# EasyEDA Pro project RPi Pico 2+.epro

# Schematic Schematic1
Board Name: Board1; Create Date: 2025-11-03; Page Name: P1; Project Name: RPi Pico 2 Plus; Schematic Name: Schematic1; Update Date: 2025-11-04; Company: EasyEDA.com; Page Size: A4; Version: V1.0
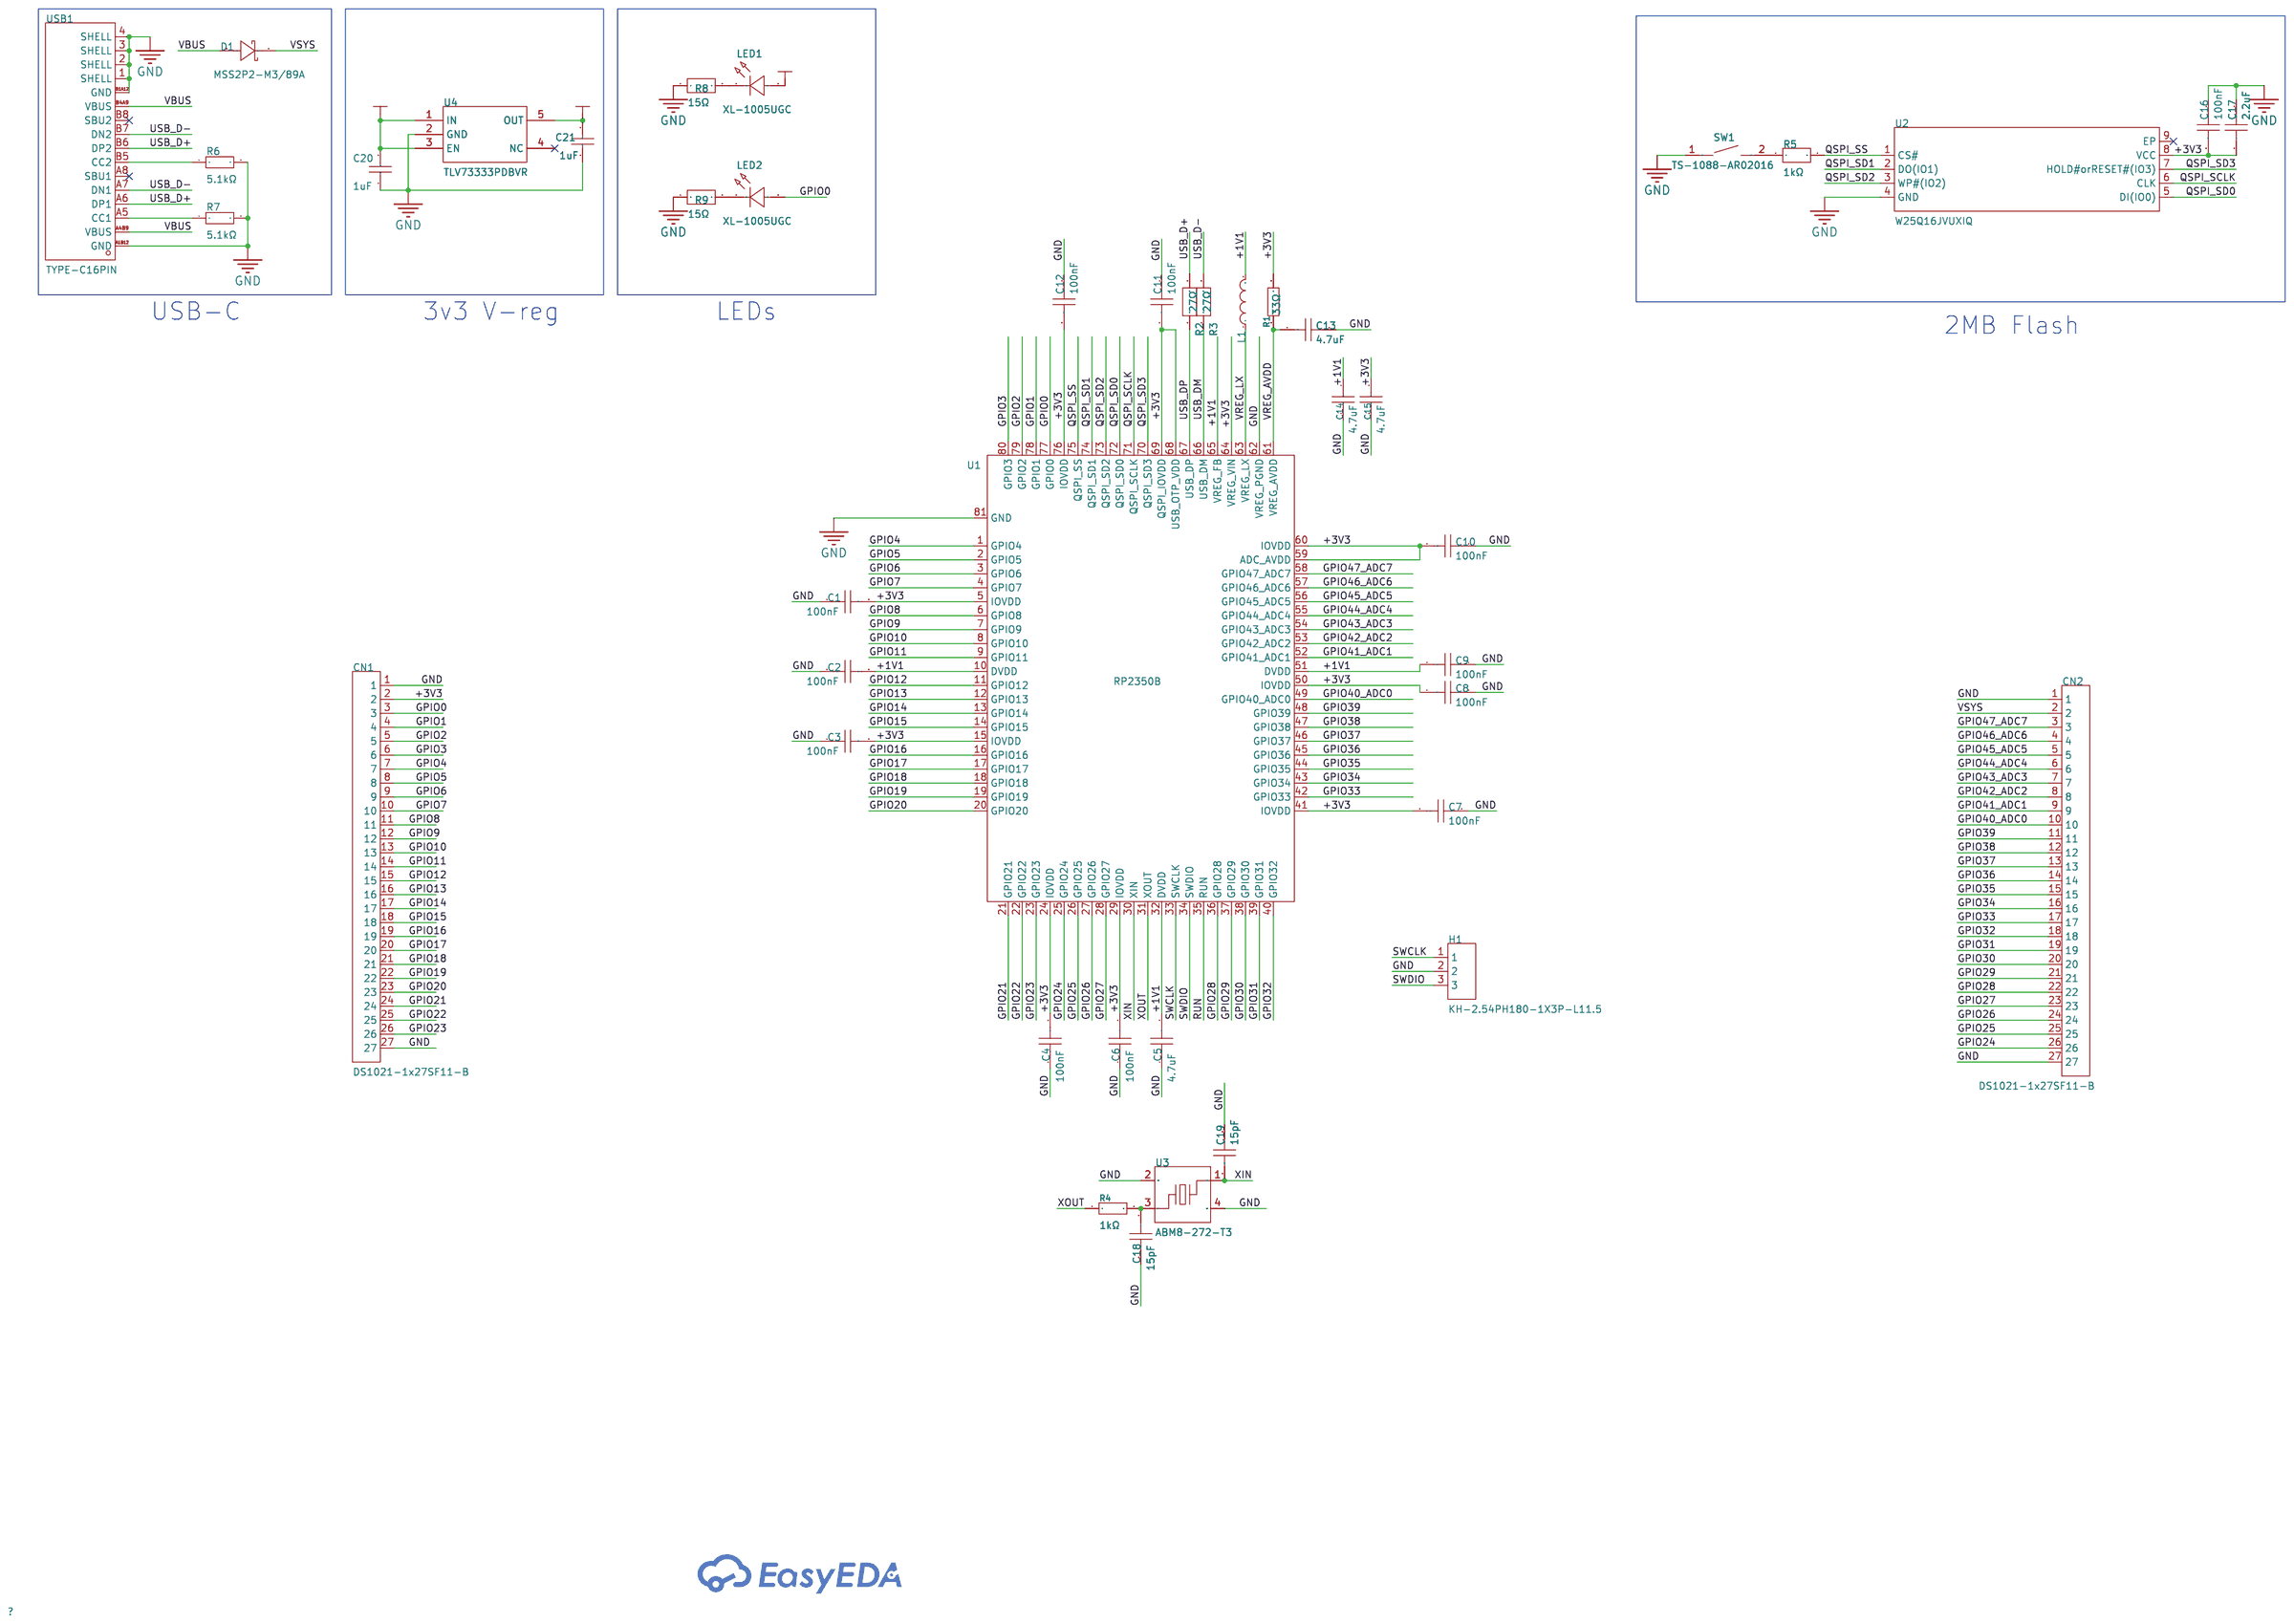
[diagram p0: schematic sheet]

## Parts
C1  100nF  [C0201]
C2  100nF  [C0201]
C3  100nF  [C0201]
C4  100nF  [C0201]
C5  4.7uF  [C0201]
C6  100nF  [C0201]
C7  100nF  [C0201]
C8  100nF  [C0201]
C9  100nF  [C0201]
C10  100nF  [C0201]
C11  100nF  [C0201]
C12  100nF  [C0201]
C13  4.7uF  [C0201]
C14  4.7uF  [C0402]
C15  4.7uF  [C0402]
C16  100nF  [C0201]
C17  2.2uF  [C0201]
C18  15pF  [C0201]
C19  15pF  [C0201]
C20  1uF  [C0201]
C21  1uF  [C0201]
CN1  DS1021-1x27SF11-B  [HDR-TH_27P-P2.54-V-M]  (no BOM)
CN2  DS1021-1x27SF11-B  [HDR-TH_27P-P2.54-V-M]  (no BOM)
D1  MSS2P2-M3/89A  [DO-219AD_L2.2-W1.3-L-RD_MSS2P2-M3-89A]
H1  KH-2.54PH180-1X3P-L11.5  [HDR-TH_3P-P2.54-V-M]  (no BOM)
L1  AOTA-B201610S3R3-101-T  [IND-SMD_L2.0-W1.6_AOTA-B201610S3R3-101-T]
LED1  XL-1005UGC  [LED0402-RD_GREEN]
LED2  XL-1005UGC  [LED0402-RD_GREEN]
R1  33Ω  [R0201]
R2  27Ω  [R0201]
R3  27Ω  [R0201]
R4  1kΩ  [R0201]
R5  1kΩ  [R0201]
R6  5.1kΩ  [R0201]
R7  5.1kΩ  [R0201]
R8  15Ω  [R0402]
R9  15Ω  [R0402]
SW1  TS-1088-AR02016  [SW-SMD_L3.9-W3.0-P4.45]
U1  RP2350B  [QFN-80_L10.0-W10.0-P0.40-TL-EP3.4]
U2  W25Q16JVUXIQ  [USON-8_L3.0-W2.0-P0.50-BL-EP]
U3  ABM8-272-T3  [CRYSTAL-SMD_4P-L3.2-W2.5-BL]
U4  TLV73333PDBVR  [SOT-23-5_L3.0-W1.7-P0.95-LS2.8-BR]
USB1  TYPE-C16PIN  [USB-C-SMD_TYPE-C16PIN]

## Library data of the parts
C1-C4 C6-C12 C16 = GRM033R60J104KE19D: Capacitance: Tolerance:±10% Tolerance:±10% Voltage Rated: Temperature Coefficient:; LCSC Part Name: 100nF ±10% 6.3V; Supplier Part: C76928; Manufacturer: muRata(村田); Supplier Footprint: 0201; Datasheet: https://atta.szlcsc.com/upload/public/pdf/source/20180307/C76928_15204090936861407718.pdf; Supplier: LCSC; Tolerance: ±10%
C5 C13 = GRM035R60J475ME15D: Capacitance:4.7uF Tolerance:±20% Tolerance:±20% Voltage Rating:6.3V Temperature Coefficient:X5R; LCSC Part Name: 4.7uF ±20% 6.3V; Supplier Part: C335103; Manufacturer: muRata(村田); Supplier Footprint: 0201; Datasheet: https://item.szlcsc.com/datasheet/GRM035R60J475ME15D/313624.html; Supplier: LCSC; Tolerance: ±20%; Voltage Rating: 6.3V; Temperature Coefficient: X5R
C14 C15 = CL05A475MP5NRNC: Capacitance:4.7uF Tolerance:±20% Tolerance:±20% Voltage Rating:10V Temperature Coefficient:X5R; LCSC Part Name: 4.7uF ±20% 10V; Supplier Part: C23733; Manufacturer: SAMSUNG(三星); Supplier Footprint: 0402; Datasheet: https://item.szlcsc.com/datasheet/CL05A475MP5NRNC/24469.html; Supplier: LCSC; Tolerance: ±20%; Voltage Rating: 10V; Temperature Coefficient: X5R
C17 = 0201X225M6R3NT: Capacitance:2.2uF Tolerance:±20% Tolerance:±20% Voltage Rating:6.3V Temperature Coefficient:X5R; LCSC Part Name: 2.2uF ±20% 6.3V; Supplier Part: C285111; Manufacturer: FH(风华); Supplier Footprint: 0201; JLCPCB Part Class: Extended Part; Datasheet: https://atta.szlcsc.com/upload/public/pdf/source/20200305/C486355_26A10D38EF8C2A5C37091D0039909270.pdf; Supplier: LCSC; Tolerance: ±20%; Voltage Rating: 6.3V; Temperature Coefficient: X5R
C18 C19 = CC0201JRNPO9BN150: Capacitance: Tolerance:±5% Tolerance:±5% Voltage Rated: Temperature Coefficient:; LCSC Part Name: 15pF ±5% 50V; Supplier Part: C277480; Manufacturer: YAGEO(国巨); Supplier Footprint: 0201; JLCPCB Part Class: Extended Part; Datasheet: https://atta.szlcsc.com/upload/public/pdf/source/20181008/C309499_21CC21451B82C39E3D92150FD6B30293.pdf; Supplier: LCSC; Tolerance: ±5%
C20 C21 = CL03A105MQ3CSNH: Capacitance:1uF Tolerance:±20% Tolerance:±20% Voltage Rating:6.3V Temperature Coefficient:X5R; LCSC Part Name: 1uF ±20% 6.3V; Supplier Part: C53067; Manufacturer: SAMSUNG(三星); Supplier Footprint: 0201; JLCPCB Part Class: Extended Part; Datasheet: https://item.szlcsc.com/datasheet/CL03A105MQ3CSNH/54083.html; Supplier: LCSC; Tolerance: ±20%; Voltage Rating: 6.3V; Temperature Coefficient: X5R
CN1 CN2 = DS1021-1x27SF11-B: Pin Structure:1x27P Pitch:2.54mm Mounting Type:Straight Number of Rows:Single Row Number of Pins:27P; LCSC Part Name: 1x27P 间距:2.54mm 直插; Supplier Part: C7430383; Manufacturer: CONNFLY; Supplier Footprint: 插件,P=2.54mm; JLCPCB Part Class: Extended Part; Datasheet: https://atta.szlcsc.com/upload/public/pdf/source/20241114/4F2B0C155C1138FA911DFA8877210959.pdf; Supplier: LCSC; Pin Structure: 1x27P; Pitch: 2.54mm; Mounting Type: Straight; Number of Rows: Single Row; Number of Pins: 27P
D1 = MSS2P2-M3/89A: Diode Configuration:1 Independent Voltage - Forward(Vf@If):520mV@2A Voltage - DC Reverse(Vr):20V Current - Rectified:2A Reverse Leakage Current (Ir):250uA@20V Operating Junction Temperature Range:-55℃~+150℃ Operating Junction Temperature Range:-55℃~+150℃; LCSC Part Name: 电压:20V 电流:2A; Supplier Part: C2978531; Manufacturer: VISHAY(威世); Supplier Footprint: MicroSMP; JLCPCB Part Class: Extended Part; Datasheet: https://item.szlcsc.com/datasheet/MSS2P2-M3%252F89A/3391953.html; Supplier: LCSC; Diode Configuration: 1 Independent; Voltage - Forward(Vf@If): 520mV@2A; Voltage - DC Reverse(Vr): 20V; Current - Rectified: 2A; Reverse Leakage Current (Ir): 250uA@20V; Operating Junction Temperature Range: -55℃~+150℃; Non-Repetitive Peak Forward Surge Current: 30A
H1 = KH-2.54PH180-1X3P-L11.5: Pin Structure:1x3P Pitch:2.54mm Row Spacing:- Circluar Pins/Square Pins:Policy Mounting Type:Straight Number of Rows:Single Row Number of Pins:3P Current Rating:3A Voltage Rating (Max):- Length of Mating Pin:6mm Insulation Height:2.5mm Length of End Conne; LCSC Part Name: 1x3P 间距:2.54mm 方针 直插; Supplier Part: C2932698; Manufacturer: kinghelm(金航标); Supplier Footprint: 插件,P=2.54mm; JLCPCB Part Class: Extended Part; Datasheet: https://atta.szlcsc.com/upload/public/pdf/source/20211220/D2AB060C07EA7DD91A5B4AA994AB98CA.pdf; Supplier: LCSC; Pin Structure: 1x3P; Pitch: 2.54mm; Circluar Pins/Square Pins: Policy; Mounting Type: Straight; Number of Rows: Single Row; Number of Pins: 3P; Current Rating: 3A; Length of Mating Pin: 6mm; Insulation Height: 2.5mm; Length of End Connection Pin: 3mm; Operating Temperature: -40℃~+105℃; Color: Black
L1 = AOTA-B201610S3R3-101-T: Supplier Part: C42411119; Manufacturer: ABRACON; Supplier Footprint: 0806; Datasheet: https://item.szlcsc.com/datasheet/AOTA-B201610S3R3-101-T/44392932.html; Supplier: LCSC
LED1 LED2 = XL-1005UGC_C965793: Illumination Color:Emerald Green Voltage - Forward(Vf):3V Voltage - Forward(Vf):3V Power(Watts):80mW Forward Current:25mA Wavelength - Dominant:516nm~531nm Wavelength - Dominant:516nm~531nm Peak Wavelength:531nm Lens Color:Water Clear Color Temperature:-; LCSC Part Name: 0402翠绿贴片式发光二极管; Supplier Part: C965793; Manufacturer: XINGLIGHT(成兴光); Supplier Footprint: 0402; Datasheet: https://item.szlcsc.com/datasheet/XL-1005UGC/1051402.html; Supplier: LCSC; Illumination Color: Emerald Green; Voltage - Forward(Vf): 3V; Power(Watts): 80mW; Forward Current: 25mA; Wavelength - Dominant: 516nm~531nm; Peak Wavelength: 531nm; Lens Color: Water Clear; Luminous Intensity: 249mcd; Viewing Angle: 120°; Mounting Style: op View Mount; Operating Temperature: -40℃~+85℃
R1 = 0201WMJ0330TEE: Type:Thick Film Resistor Resistance:33Ω Tolerance:±5% Tolerance:±5% Power(Watts):50mW Voltage-Supply(Max):25V Temperature Coefficient:±200ppm/℃ Temperature Coefficient:±200ppm/℃ Operating Temperature:-55℃~+155℃ Operating Temperature:-55℃~+155℃; LCSC Part Name: 33Ω ±5% 50mW 厚膜电阻; Supplier Part: C423356; Manufacturer: UNI-ROYAL(厚声); Supplier Footprint: 0201; JLCPCB Part Class: Extended Part; Datasheet: https://item.szlcsc.com/datasheet/0201WMJ0330TEE/416306.html; Supplier: LCSC; Type: Thick Film Resistor; Tolerance: ±5%; Power(Watts): 50mW; Voltage-Supply(Max): 25V; Temperature Coefficient: ±200ppm/℃; Operating Temperature: -55℃~+155℃
R2 R3 = 0201WMF270JTEE: Type:Thick Film Resistors Resistance:27Ω Tolerance:±1% Tolerance:±1% Power(Watts): Overload Voltage (Max): Temperature Coefficient:±200ppm/℃ Temperature Coefficient:±200ppm/℃ Operating Temperature Range:-55℃~+155℃ Operating Temperature Range:-55℃~+155℃; LCSC Part Name: 27Ω ±1% 50mW 厚膜电阻; Supplier Part: C473051; Manufacturer: UNI-ROYAL(厚声); Supplier Footprint: 0201; JLCPCB Part Class: Extended Part; Datasheet: https://atta.szlcsc.com/upload/public/pdf/source/20200306/C422600_1E6D84923E4A46A82E41ADD87F860B5C.pdf; Supplier: LCSC; Type: Thick Film Resistors; Tolerance: ±1%; Temperature Coefficient: ±200ppm/℃; Operating Temperature Range: -55℃~+155℃
R4 = RTT01102JTH: Type:Thick Film Resistor Resistance:1kΩ Tolerance:±5% Tolerance:±5% Power(Watts):50mW Voltage-Supply(Max):25V Temperature Coefficient:±200ppm/℃ Temperature Coefficient:±200ppm/℃ Operating Temperature:-55℃~+125℃ Operating Temperature:-55℃~+125℃; LCSC Part Name: 厚膜电阻 1kΩ ±5% 50mW; Supplier Part: C102689; Manufacturer: RALEC(旺诠); Supplier Footprint: 0201; JLCPCB Part Class: Extended Part; Datasheet: https://item.szlcsc.com/datasheet/RTT01102JTH/103904.html; Supplier: LCSC; Type: Thick Film Resistor; Tolerance: ±5%; Power(Watts): 50mW; Voltage-Supply(Max): 25V; Temperature Coefficient: ±200ppm/℃; Operating Temperature: -55℃~+125℃
R5 = FRC0201F1001TS: Type:Thick Film Resistor Resistance:1kΩ Tolerance:±1% Tolerance:±1% Power(Watts):50mW Temperature Coefficient:±200ppm/℃ Temperature Coefficient:±200ppm/℃; LCSC Part Name: 厚膜电阻 1kΩ ±1% 50mW; Supplier Part: C7467283; Manufacturer: FOJAN(富捷); Supplier Footprint: 0201; JLCPCB Part Class: Extended Part; Datasheet: https://atta.szlcsc.com/upload/public/pdf/source/20230915/D88BDA77B27A9698C44CA869125B965F.pdf; Supplier: LCSC; Type: Thick Film Resistor; Tolerance: ±1%; Power(Watts): 50mW; Temperature Coefficient: ±200ppm/℃
R6 R7 = RC0201FR-075K1L: Type:Thick Film Resistors Resistance: Tolerance:±1% Tolerance:±1% Power(Watts): Overload Voltage (Max): Temperature Coefficient:±200ppm/℃ Temperature Coefficient:±200ppm/℃ Operating Temperature Range:-55℃~+125℃ Operating Temperature Range:-55℃~+125℃; LCSC Part Name: 厚膜电阻 5.1kΩ ±1% 50mW; Supplier Part: C274341; Manufacturer: YAGEO(国巨); Supplier Footprint: 0201; JLCPCB Part Class: Extended Part; Datasheet: https://atta.szlcsc.com/upload/public/pdf/source/20180821/C275644_0D56F95EFF785E7D9A1FEF436B37DA78.pdf; Supplier: LCSC; Type: Thick Film Resistors; Tolerance: ±1%; Temperature Coefficient: ±200ppm/℃; Operating Temperature Range: -55℃~+125℃
R8 R9 = SCR0402J15R: Type:Thick Film Resistor Resistance:15Ω Tolerance:±5% Tolerance:±5% Power(Watts):62.5mW Voltage-Supply(Max):50V Operating Temperature:-55℃~+155℃ Operating Temperature:-55℃~+155℃; LCSC Part Name: 厚膜电阻 15Ω ±5% 62.5mW; Supplier Part: C3017452; Manufacturer: VO(翔胜); Supplier Footprint: 0402; Datasheet: https://atta.szlcsc.com/upload/public/pdf/source/20220513/247AF9639BA21CF93567DC289CCC6A22.pdf; Supplier: LCSC; Type: Thick Film Resistor; Tolerance: ±5%; Power(Watts): 62.5mW; Voltage-Supply(Max): 50V; Operating Temperature: -55℃~+155℃
SW1 = TS-1088-AR02016: Circuit:SPST Actuator Style:Round Button Operating Force:160gf Mounting Style:Brick nogging Switch Length:4mm Switch Width:3mm Switch Height:2mm Strike Gundam:不带 Contact Current:50mA Voltage Rating (DC):12V Insulation Resistance:100MΩ Actuator/Cap Color:B; LCSC Part Name: 4*3*2mm 立贴 轻触开关; Supplier Part: C720477; Manufacturer: XUNPU(讯普); Supplier Footprint: SMD; JLCPCB Part Class: Basic Part; Datasheet: https://atta.szlcsc.com/upload/public/pdf/source/20200810/C720475_60D09DD6C54279ADDB2DC25100F1CC11.pdf; Supplier: LCSC; Circuit: SPST; Actuator Style: Round Button; Operating Force: 160gf; Mounting Style: Brick nogging; Switch Length: 4mm; Switch Width: 3mm; Switch Height: 2mm; Strike Gundam: 不带; Contact Current: 50mA; Voltage Rating (DC): 12V; Insulation Resistance: 100MΩ; Actuator/Cap Color: Black; Pin Style: SMDSplicing; Mechanical Life: 10万次; Operating Temperature: -30℃~+80℃
U1 = RP2350B_C42415655: LCSC Part Name: 微控制器; Supplier Part: C42415655; Manufacturer: Raspberry Pi(树莓派); Supplier Footprint: QFN-80-EP(10x10); JLCPCB Part Class: Extended Part; Datasheet: https://item.szlcsc.com/datasheet/RP2350B/44413055.html; Supplier: LCSC
U2 = W25Q16JVUXIQ: Interface:SPI Memory Size:16Mbit Clock Frequency:133MHz Voltage - Supply:2.7V~3.6V Voltage - Supply:2.7V~3.6V Program / Erase Cycles:100,000 Cycles Page Programming Time (Tpp):3ms Data Retention - TDR (Year):20 Years; Supplier Part: C2843335; Manufacturer: Winbond(华邦); Supplier Footprint: USON-8-EP(2x3); Datasheet: https://atta.szlcsc.com/upload/public/pdf/source/20210629/C2843335_FB4D78B5076715625DC0C83F790D3044.pdf; Supplier: LCSC; Interface: SPI; Memory Size: 16Mbit; Clock Frequency: 133MHz; Voltage - Supply: 2.7V~3.6V; Program / Erase Cycles: 100,000 Cycles; Page Programming Time (Tpp): 3ms; Data Retention - TDR (Year): 20 Years
U3 = ABM8-272-T3_C20625731: Supplier Part: C20625731; Manufacturer: ABRACON; Supplier Footprint: SMD3225-4P; Datasheet: https://atta.szlcsc.com/upload/public/pdf/source/20240227/A8BE43F636D80F75C9AF5C59EDF21E9A.pdf; Supplier: LCSC
U4 = TLV73333PDBVR: Output Type:Fixed Maximum Input Voltage:5.5V Output Voltage:3.3V Output Voltage:3.3V Output Current:300mA Power Supply Rejection Ratio (PSRR):68dB@(100Hz)；28dB@(100kHz) Dropout Voltage:270mV@(300mA) standby current:60uA Feature:ESD Protection；Surge Protec; LCSC Part Name: 具有使能功能的 300mA、低 IQ、低压降无电容稳压器; Supplier Part: C134139; Manufacturer: TI(德州仪器); Supplier Footprint: SOT-23-5; JLCPCB Part Class: Extended Part; Datasheet: https://www.ti.com/cn/lit/gpn/tlv733p; Supplier: LCSC; Output Type: Fixed; Maximum Input Voltage: 5.5V; Output Voltage: 3.3V; Output Current: 300mA; Power Supply Rejection Ratio (PSRR): 68dB@(100Hz)；28dB@(100kHz); Dropout Voltage: 270mV@(300mA); standby current: 60uA; Feature: ESD Protection；Surge Protection；Automatic Discharge Function；Low ESR；Thermal Protection(TSD)；Under-voltage Lockout；Overcurrent Protection(OCP)；With ability；Anti-Siphon; Operating Temperature: -40℃~+125℃@(Tj); Output Polarity: Positive electrode; Number of Outputs: 1
USB1 = TYPE-C16PIN: Connector Type:Type-C Protocol Standard:USB 3.1 Gender:Female Mounting Type:Surface Mount, Right Angle Number of Contacts:16P Number of Ports:1 Current Rating-Power:3A Voltage Rating:30V Connect-Disconnect Life:10,000 Cycles Detection color:Black Operatin; LCSC Part Name: Type-C 母 卧贴; Supplier Part: C393939; Manufacturer: SHOU HAN(首韩); Supplier Footprint: SMD; Datasheet: https://atta.szlcsc.com/upload/public/pdf/source/20250618/9FBF2A26CFCE0E69298FA0B726710E9E.pdf; Supplier: LCSC; Connector Type: Type-C; Protocol Standard: USB 3.1; Gender: Female; Mounting Type: Surface Mount, Right Angle; Number of Contacts: 16P; Number of Ports: 1; Current Rating-Power: 3A; Voltage Rating: 30V; Connect-Disconnect Life: 10,000 Cycles; Detection color: Black; Operating Temperature: -40℃~+85℃

## Nets
+1V1: C2.2 C5.2 C9.2 C14.2 L1.2 U1.10(DVDD) U1.32(DVDD) U1.51(DVDD) U1.65(VREG_FB)
+3V3: C1.2 C3.2 C4.2 C6.2 C7.2 C8.2 C10.2 C11.2 C12.2 C15.2 C16.2 C17.1 C21.2 CN1.2 LED1.2(A) R1.2 U1.5(IOVDD) U1.15(IOVDD) U1.24(IOVDD) U1.29(IOVDD) U1.41(IOVDD) U1.50(IOVDD) U1.59(ADC_AVDD) U1.60(IOVDD) U1.64(VREG_VIN) U1.68(USB_OTP_VDD) U1.69(QSPI_IOVDD) U1.76(IOVDD) U2.8(VCC) U4.5(OUT)
GND: C1.1 C2.1 C3.1 C4.1 C5.1 C6.1 C7.1 C8.1 C9.1 C10.1 C11.1 C12.1 C13.1 C14.1 C15.1 C16.1 C17.2 C18.1 C19.2 C20.1 C21.1 CN1.1 CN1.27 CN2.1 CN2.27 H1.2 R6.2 R7.2 R8.1 R9.1 SW1.1 U1.62(VREG_PGND) U1.81(GND) U2.4(GND) U3.2(GND) U3.4(GND) U4.2(GND) USB1.1(SHELL) USB1.2(SHELL) USB1.3(SHELL) USB1.4(SHELL) USB1.A1B12(GND) USB1.B1A12(GND)
VBUS: D1.2(A) USB1.A4B9(VBUS) USB1.B4A9(VBUS)
GPIO0: CN1.3 LED2.2(A) U1.77(GPIO0)
GPIO1: CN1.4 U1.78(GPIO1)
GPIO2: CN1.5 U1.79(GPIO2)
GPIO3: CN1.6 U1.80(GPIO3)
GPIO4: CN1.7 U1.1(GPIO4)
GPIO5: CN1.8 U1.2(GPIO5)
GPIO6: CN1.9 U1.3(GPIO6)
GPIO7: CN1.10 U1.4(GPIO7)
GPIO8: CN1.11 U1.6(GPIO8)
GPIO9: CN1.12 U1.7(GPIO9)
GPIO10: CN1.13 U1.8(GPIO10)
GPIO11: CN1.14 U1.9(GPIO11)
GPIO12: CN1.15 U1.11(GPIO12)
GPIO13: CN1.16 U1.12(GPIO13)
GPIO14: CN1.17 U1.13(GPIO14)
GPIO15: CN1.18 U1.14(GPIO15)
GPIO16: CN1.19 U1.16(GPIO16)
GPIO17: CN1.20 U1.17(GPIO17)
GPIO18: CN1.21 U1.18(GPIO18)
GPIO19: CN1.22 U1.19(GPIO19)
GPIO20: CN1.23 U1.20(GPIO20)
GPIO21: CN1.24 U1.21(GPIO21)
GPIO22: CN1.25 U1.22(GPIO22)
GPIO23: CN1.26 U1.23(GPIO23)
GPIO24: CN2.26 U1.25(GPIO24)
GPIO25: CN2.25 U1.26(GPIO25)
GPIO26: CN2.24 U1.27(GPIO26)
GPIO27: CN2.23 U1.28(GPIO27)
GPIO28: CN2.22 U1.36(GPIO28)
GPIO29: CN2.21 U1.37(GPIO29)
GPIO30: CN2.20 U1.38(GPIO30)
GPIO31: CN2.19 U1.39(GPIO31)
GPIO32: CN2.18 U1.40(GPIO32)
GPIO33: CN2.17 U1.42(GPIO33)
GPIO34: CN2.16 U1.43(GPIO34)
GPIO35: CN2.15 U1.44(GPIO35)
GPIO36: CN2.14 U1.45(GPIO36)
GPIO37: CN2.13 U1.46(GPIO37)
GPIO38: CN2.12 U1.47(GPIO38)
GPIO39: CN2.11 U1.48(GPIO39)
GPIO40_ADC0: CN2.10 U1.49(GPIO40_ADC0)
GPIO41_ADC1: CN2.9 U1.52(GPIO41_ADC1)
GPIO42_ADC2: CN2.8 U1.53(GPIO42_ADC2)
GPIO43_ADC3: CN2.7 U1.54(GPIO43_ADC3)
GPIO44_ADC4: CN2.6 U1.55(GPIO44_ADC4)
GPIO45_ADC5: CN2.5 U1.56(GPIO45_ADC5)
GPIO46_ADC6: CN2.4 U1.57(GPIO46_ADC6)
GPIO47_ADC7: CN2.3 U1.58(GPIO47_ADC7)
QSPI_SCLK: U1.71(QSPI_SCLK) U2.6(CLK)
QSPI_SD0: U1.72(QSPI_SD0) U2.5(DI(IO0))
QSPI_SD1: U1.74(QSPI_SD1) U2.2(DO(IO1))
QSPI_SD2: U1.73(QSPI_SD2) U2.3(WP#(IO2))
QSPI_SD3: U1.70(QSPI_SD3) U2.7(HOLD#orRESET#(IO3))
QSPI_SS: R5.2 U1.75(QSPI_SS) U2.1(CS#)
RUN: U1.35(RUN)
SWCLK: H1.1 U1.33(SWCLK)
SWDIO: H1.3 U1.34(SWDIO)
USB_D+: R2.2 USB1.A6(DP1) USB1.B6(DP2)
USB_D-: R3.2 USB1.A7(DN1) USB1.B7(DN2)
USB_DM: R3.1 U1.66(USB_DM)
USB_DP: R2.1 U1.67(USB_DP)
VREG_AVDD: C13.2 R1.1 U1.61(VREG_AVDD)
VREG_LX: L1.1 U1.63(VREG_LX)
VSYS: C20.2 CN2.2 D1.1(K) U4.1(IN) U4.3(EN)
XIN: C19.1 U1.30(XIN) U3.1
XOUT: R4.1 U1.31(XOUT)
$1N292: R6.1 USB1.B5(CC2)
$1N293: R7.1 USB1.A5(CC1)
$1N767: R5.1 SW1.2
$1N2957: C18.2 R4.2 U3.3
$1N4117: LED1.1(K) R8.2
$1N4264: LED2.1(K) R9.2

Not connected (* = marked no-connect by the designer): U2 9(EP)*; U4 4(NC)*; USB1 A8(SBU1)* B8(SBU2)*

## Notes on the sheet
- USB-C
- 3v3 V-reg
- LEDs
- 2MB Flash

# Board PCB1
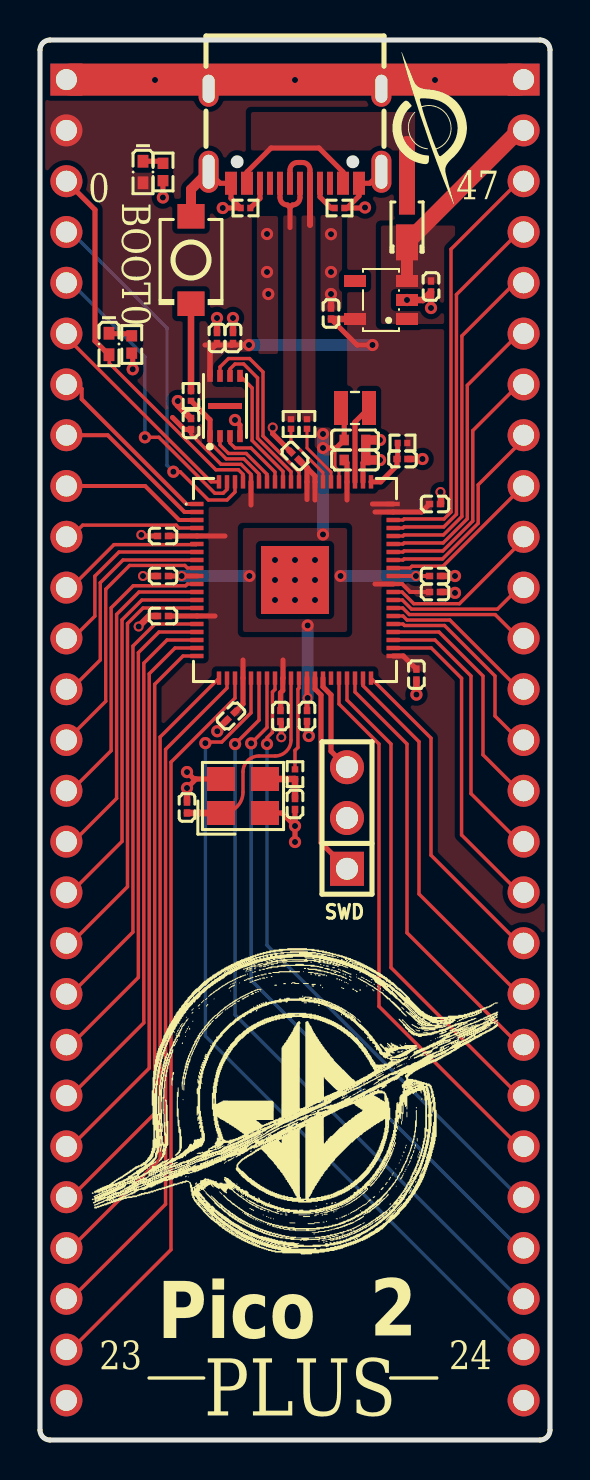
[diagram p1: board, top side]
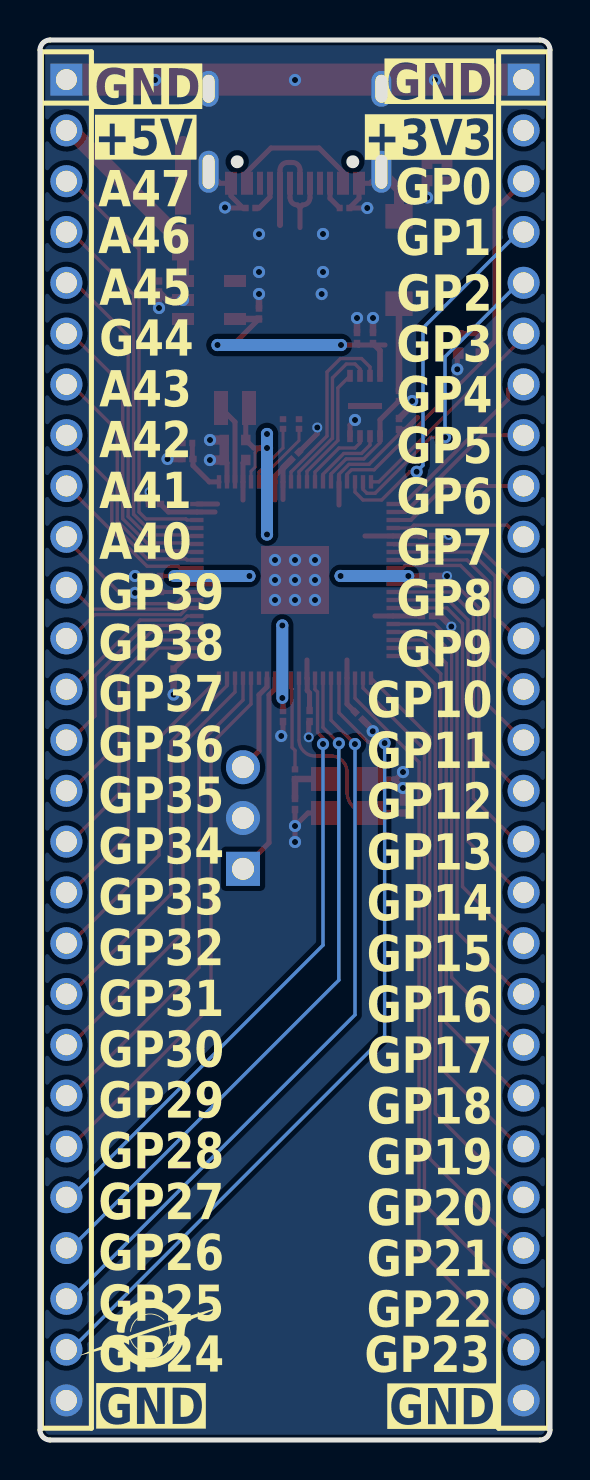
[diagram p2: board, bottom side, seen from below]

Outline 25.5 x 70 mm; copper layers: Top Layer, Bottom Layer. Coordinates in mm from the lower left corner of the outline.
Outline path: 0,69.5 0,0.5 arc(0.15,0.15) 0.5,0 25,0 arc(25.35,0.15) 25.5,0.5 25.5,69.5 arc(25.35,69.85) 25,70 0.5,70 arc(0.15,69.85) 0,69.5
Stack: Top Layer 0.035mm / Dielectric1 1.51mm FR4 er 4.5 / Bottom Layer 0.035mm

## Design rules (mm)
template: Custom Config
spacing copperThickness1oz (default): track to track 0.102, other pairs 0.152 to 0.3
spacing copperThickness2oz: track to track 0.203, other pairs 0.152 to 0.3
track width copperThickness1oz (default): min 0.127, default 0.254, max 2.54
track width copperThickness2oz: min 0.203, default 0.254, max 2.54
differential pair differentialPair (default): width min 0.127, default 0.254, max 2.54; gap min 0.152, default 0.152
via viaSize (default): diameter min 0.5, default 0.61, max 10; hole min 0.3, default 0.305, max 6.3

## Placement (name value [footprint] x y rotation side)
C1  100nF  [C0201]  6.15 45.2 0 top
C2  100nF  [C0201]  6.15 43.2 0 top
C3  100nF  [C0201]  6.15 41.2 0 top
C4  100nF  [C0201]  9.55 36.2 45 top
C5  4.7uF  [C0201]  13.35 36.2 90 top
C6  100nF  [C0201]  12.02 36.2 90 top
C7  100nF  [C0201]  18.82 38.27 90 top
C8  100nF  [C0201]  19.75 42.4 180 top
C9  100nF  [C0201]  19.75 43.2 180 top
C10  100nF  [C0201]  19.75 46.8 180 top
C11  100nF  [C0201]  12.75 49.2 315 top
C12  100nF  [C0201]  7.55 50.8 270 top
C13  4.7uF  [C0201]  18.12 49.05 180 top
C14  4.7uF  [C0402]  15.75 50 180 top
C15  4.7uF  [C0402]  15.75 49 180 top
C16  100nF  [C0201]  8.85 55.1 270 top
C17  2.2uF  [C0201]  9.65 55.1 90 top
C18  15pF  [C0201]  12.75 31.8 90 top
C19  15pF  [C0201]  7.35 31.62 90 top
C20  1uF  [C0201]  19.55 57.68 90 top
C21  1uF  [C0201]  14.55 56.32 270 top
CN1  DS1021-1x27SF11-B  [HDR-TH_27P-P2.54-V-M]  1.32 35 270 bottom
CN2  DS1021-1x27SF11-B  [HDR-TH_27P-P2.54-V-M]  24.18 35 270 bottom
D1  MSS2P2-M3/89A  [DO-219AD_L2.2-W1.3-L-RD_MSS2P2-M3-89A]  18.35 60.8 90 top
L1  AOTA-B201610S3R3-101-T  [IND-SMD_L2.0-W1.6_AOTA-B201610S3R3-101-T]  15.75 51.6 180 top
LED1  XL-1005UGC  [LED0402-RD_GREEN]  5.15 63.4 270 top
LED2  XL-1005UGC  [LED0402-RD_GREEN]  3.45 54.8 270 top
R1  33Ω  [R0201]  18.12 49.85 0 top
R2  27Ω  [R0201]  12.55 50.8 90 top
R3  27Ω  [R0201]  13.35 50.8 90 top
R4  1kΩ  [R0201]  12.75 33.29 270 top
R5  1kΩ  [R0201]  7.55 52.2 270 top
R6  5.1kΩ  [R0201]  10.28 61.6 180 top
R7  5.1kΩ  [R0201]  14.97 61.6 0 top
R8  15Ω  [R0402]  6.15 63.4 90 top
R9  15Ω  [R0402]  4.59 54.78 90 top
SW1  TS-1088-AR02016  [SW-SMD_L3.9-W3.0-P4.45]  7.55 59 270 top
SWD  KH-2.54PH180-1X3P-L11.5  [HDR-TH_3P-P2.54-V-M]  15.35 31.1 90 top
U1  RP2350B  [QFN-80_L10.0-W10.0-P0.40-TL-EP3.4]  12.75 43 0 top
U2  W25Q16JVUXIQ  [USON-8_L3.0-W2.0-P0.50-BL-EP]  9.25 51.7 0 top
U3  ABM8-272-T3  [CRYSTAL-SMD_4P-L3.2-W2.5-BL]  10.15 32.2 0 top
U4  TLV73333PDBVR  [SOT-23-5_L3.0-W1.7-P0.95-LS2.8-BR]  17.05 57 0 top
USB1  TYPE-C16PIN  [USB-C-SMD_TYPE-C16PIN]  12.75 65.2 180 top

## Footprints (pads in the part's own frame, mm; a bottom-side part is the same pattern mirrored in y, then rotated)
C0201
  rect 0.368x0.324 smd: 1(-0.275,0) 2(0.275,0)
C0402
  rect 0.47x0.53 smd: 1(-0.54,0) 2(0.54,0)
CRYSTAL-SMD_4P-L3.2-W2.5-BL
  rect 1.4x1.2 smd: 1(-1.1,-0.85) 2(1.1,-0.85) 3(1.1,0.85) 4(-1.1,0.85)
DO-219AD_L2.2-W1.3-L-RD_MSS2P2-M3-89A
  rect 1.8x1.1 smd: 1(-0.919,0)
  rect 0.9x0.8 smd: 2(0.919,0)
HDR-TH_3P-P2.54-V-M
  rect 1.7x1.7 hole 1.1: 1(-2.54,0)
  round 1.7 hole 1.1: 2(0,0) 3(2.54,0)
HDR-TH_27P-P2.54-V-M
  rect 1.6x1.6 hole 1.05: 1(-33.02,0)
  round 1.6 hole 1.05: 2(-30.48,0) 3(-27.94,0) 4(-25.4,0) 5(-22.86,0) 6(-20.32,0) 7(-17.78,0) 8(-15.24,0) 9(-12.7,0) 10(-10.16,0) 11(-7.62,0) 12(-5.08,0) 13(-2.54,0) 14(0,0) 15(2.54,0) 16(5.08,0) 17(7.62,0) 18(10.16,0) 19(12.7,0) 20(15.24,0) 21(17.78,0) 22(20.32,0) 23(22.86,0) 24(25.4,0) 25(27.94,0) 26(30.48,0) 27(33.02,0)
IND-SMD_L2.0-W1.6_AOTA-B201610S3R3-101-T
  rect 0.7x1.7 smd: 1(-0.7,0) 2(0.7,0)
LED0402-RD_GREEN
  rect 0.636x0.54 smd: 1(-0.538,0) 2(0.538,0)
QFN-80_L10.0-W10.0-P0.40-TL-EP3.4
  rect 0.665x0.22 smd: 1(-4.907,3.8) 2(-4.907,3.4) 3(-4.907,3) 4(-4.907,2.6) 5(-4.907,2.2) 6(-4.907,1.8) 7(-4.907,1.4) 8(-4.907,1) 9(-4.907,0.6) 10(-4.907,0.2) 11(-4.907,-0.2) 12(-4.907,-0.6) 13(-4.907,-1) 14(-4.907,-1.4) 15(-4.907,-1.8) 16(-4.907,-2.2) 17(-4.907,-2.6) 18(-4.907,-3) 19(-4.907,-3.4) 20(-4.907,-3.8) 41(4.907,-3.8) 42(4.907,-3.4) 43(4.907,-3) 44(4.907,-2.6) 45(4.907,-2.2) 46(4.907,-1.8) 47(4.907,-1.4) 48(4.907,-1) 49(4.907,-0.6) 50(4.907,-0.2) 51(4.907,0.2) 52(4.907,0.6) 53(4.907,1) 54(4.907,1.4) 55(4.907,1.8) 56(4.907,2.2) 57(4.907,2.6) 58(4.907,3) 59(4.907,3.4) 60(4.907,3.8)
  rect 0.22x0.665 smd: 21(-3.8,-4.907) 22(-3.4,-4.907) 23(-3,-4.907) 24(-2.6,-4.907) 25(-2.2,-4.907) 26(-1.8,-4.907) 27(-1.4,-4.907) 28(-1,-4.907) 29(-0.6,-4.907) 30(-0.2,-4.907) 31(0.2,-4.907) 32(0.6,-4.907) 33(1,-4.907) 34(1.4,-4.907) 35(1.8,-4.907) 36(2.2,-4.907) 37(2.6,-4.907) 38(3,-4.907) 39(3.4,-4.907) 40(3.8,-4.907) 61(3.8,4.907) 62(3.4,4.907) 63(3,4.907) 64(2.6,4.907) 65(2.2,4.907) 66(1.8,4.907) 67(1.4,4.907) 68(1,4.907) 69(0.6,4.907) 70(0.2,4.907) 71(-0.2,4.907) 72(-0.6,4.907) 73(-1,4.907) 74(-1.4,4.907) 75(-1.8,4.907) 76(-2.2,4.907) 77(-2.6,4.907) 78(-3,4.907) 79(-3.4,4.907) 80(-3.8,4.907)
  rect 3.4x3.4 smd: 81(0,0)
R0201
  rect 0.303x0.324 smd: 1(-0.241,0) 2(0.241,0)
R0402
  rect 0.566x0.54 smd: 1(-0.433,0) 2(0.433,0)
SOT-23-5_L3.0-W1.7-P0.95-LS2.8-BR
  rect 1.1x0.6 smd: 1(1.3,-0.95) 2(1.3,0) 3(1.3,0.95) 4(-1.3,0.95) 5(-1.3,-0.95)
SW-SMD_L3.9-W3.0-P4.45
  rect 1.23x1.36 smd: 1(-2.185,0) 2(2.185,0)
USB-C-SMD_TYPE-C16PIN
  oval 1x2.1 hole 0.6x1.7: 1(-4.32,1.788) 2(4.32,1.788)
  oval 1x1.8 hole 0.6x1.4: 3(-4.32,-2.362) 4(4.32,-2.362)
  rect 0.6x1.15 smd: A1B12(-3.2,2.362) A4B9(-2.4,2.362) B1A12(3.2,2.362) B4A9(2.4,2.362)
  rect 0.3x1.15 smd: A5(-1.25,2.362) A6(-0.25,2.362) A7(0.25,2.362) A8(1.25,2.362) B5(1.75,2.362) B6(0.75,2.362) B7(-0.75,2.362) B8(-1.75,2.362)
USON-8_L3.0-W2.0-P0.50-BL-EP
  rect 0.28x0.6 smd: 1(-0.75,-1.508) 2(-0.25,-1.508) 3(0.25,-1.508) 4(0.75,-1.508) 5(0.75,1.508) 6(0.25,1.508) 7(-0.25,1.508) 8(-0.75,1.508)
  rect 1.7x0.3 smd: 9(0,0)

## Nets
As in the schematic, except:
GND: C1.1 C2.1 C3.1 C4.1 C5.1 C6.1 C7.1 C8.1 C9.1 C10.1 C11.1 C12.1 C13.1 C14.1 C15.1 C16.1 C17.2 C18.1 C19.2 C20.1 C21.1 CN1.1 CN1.27 CN2.1 CN2.27 R6.2 R7.2 R8.1 R9.1 SW1.1 SWD.2 U1.62 U1.81 U2.4 U3.2 U3.4 U4.2 USB1.1 USB1.2 USB1.3 USB1.4 USB1.A1B12 USB1.B1A12
SWCLK: SWD.1 U1.33
SWDIO: SWD.3 U1.34

Pads without a net: U2 9; U4 4; USB1 A8 B8

## Via types
v1: diameter 0.5, hole 0.305, Top Layer to Bottom Layer, 8 vias
v2: diameter 0.61, hole 0.305, Top Layer to Bottom Layer, 51 vias
v3: diameter 0.6, hole 0.305, Top Layer to Bottom Layer, 3 vias
v4: diameter 0.5, hole 0.3, Top Layer to Bottom Layer, 1 via

## Routing (per net, layer and track width the routed paths; a pad name or vN(x,y) marks a point on that pad's centre or on a via; arc(x,y) is an arc through that point)
+1V1: length 25.5
  Top Layer w0.15: U1.65 14.95,48.44 14.75,48.64 14.75,49.36 14.51,49.6
  Top Layer w0.2: U1.51 v1(18.8,43.2) C9.2
  Top Layer w0.254: U1.32 13.35,37.13 v1(13.38,37.1) 13.35,37.07 C5.2 ; U1.10 v1(7.08,43.2) C2.2 ; L1.2 15.21,51.44 C14.2 14.81,49.6 v2(14.15,49.6)
  Bottom Layer w0.6: v2(14.15,45.28) v2(14.15,49.6) v2(14.15,50.3) ; v3(15.03,43.2) v1(18.8,43.2) ; v1(7.08,43.2) 10.46,43.2 10.47,43.21 ; v3(13.38,40.73) v1(13.38,37.1)
  vias: v3(10.47,43.2)
+3V3: length 45.6
  Top Layer w0.17: U1.76 10.55,48.28 10.05,48.78 9.05,48.78 7.55,50.29 C12.2
  Top Layer w0.2: C8.2 18.51,42.4 18.11,42.8 U1.50
  Top Layer w0.254: 16.75,46.4 U1.59 19.08,46.4 C10.2 ; v2(16.62,54.75) 15.85,54.75 C21.2 ; 8.75,41.2 U1.15 C3.2 ; 13.75,47 U1.68 13.75,48.2 13.35,48.6 U1.69 13.35,47.03 ; 18.82,38.55 18.17,39.2 U1.41 ; C6.2 12.02,37.36 12.14,37.47 12.14,38.08 U1.29 12.15,39 ; 9.25,45.2 U1.5 C1.2 ; 6.62,51.12 7.22,50.53 C12.2 ; 8.25,54.75 v2(10.45,54.75) ; C15.2 15.35,48.86 U1.64 15.35,47 ; 10.15,39 U1.24 10.15,36.8 C4.2 ; U1.76 10.55,46.75 ; U1.50 16.75,42.8 ; U1.60 16.62,46.8
  Top Layer w0.28: U2.8 8.5,54.48 C16.2 ; 9.57,54.75 C17.1
  Top Layer w0.324: U4.5 C21.2 ; 13.35,48.6 C11.2
  Bottom Layer w0.6: v2(10.45,54.75) v2(16.62,54.75)
GND: length 60.8
  Top Layer w0.254: C5.1 13.35,35.29 v2(13.44,35.2) ; U3.4 7.8,33.05 ; 7.8,33.05 7.7,33.05 v2(7.35,33.4) ; 7.8,33.05 v2(7.35,32.6) ; v1(11.64,50.62) 11.64,50.31 C11.1 ; v2(9.75,51) 10,50.75 U2.4 ; 15.35,61.6 16.22,61.6 v2(16.25,61.62) ; 15.35,61.6 15.95,62.2 USB1.A1B12 16.5,62.84 USB1.1 ; 15.35,61.6 R7.2 ; C1.1 5.12,45.2 v4(5.06,45.25) ; C18.1 v2(12.75,30.7) ; v2(12.75,30.7) 12.1,31.35 U3.2 ; v2(12.75,30.7) v2(12.75,29.9) ; U1.62 16.15,48.86 C15.1 ; v2(9.14,61.6) R6.2 9.55,62.08 USB1.B1A12 9,62.84 USB1.2 ; v2(6.15,62.13) 6.15,62.89 ; C6.1 12.06,35.88 v1(12.06,35.14) ; v2(4.64,53.54) 4.64,54.25
  Top Layer w0.324: C2.1 v1(5.15,43.2) ; C8.1 20.71,42.4 v2(20.75,42.36) ; C3.1 5.46,41.2 v1(4.93,40.67) ; 14.55,56.6 v2(14.55,57.3) ; C9.1 v2(20.75,43.2) ; C10.1 20.05,46.83 20.05,47.4 ; C4.1 8.86,35.51 v2(8.86,35.44) ; C7.1 v2(18.82,37.27) ; C17.2 v2(9.65,56.1) ; C13.1 v2(19.12,49.05) ; C12.1 6.89,51.73 v2(6.89,51.95) ; C16.1 v2(8.85,56.1) ; v2(18.35,57) 19.15,57 19.55,57.4 v2(19.55,56.6) ; 7.35,31.9 v2(7.35,32.6)
  Top Layer w0.47: v2(17,50) C14.1 C15.1 ; v2(17,49) 16.29,49
  Top Layer w0.5: USB1.2 7.55,62.53 SW1.1
  Top Layer w1.6: 23.95,68.02 1.55,68.02
  vias: v1(20.02,47.4) v2(5.75,68) v2(11.35,60.3) v2(11.35,58.4) v2(11.41,57.3) v2(11.75,44) v2(11.75,43) v2(11.75,42) v2(12.75,68) v2(12.75,44) v2(12.75,43) v2(12.75,42) v2(13.75,44) v2(13.75,43) v2(13.75,42) v2(14.55,60.29) v2(14.55,58.4) v2(19.75,68)
VBUS: length 10
  Top Layer w0.254: USB1.A4B9 15.15,63.4 13.95,64.6 11.55,64.6 10.35,63.4 USB1.B4A9
  Top Layer w0.8: D1.2 18.35,64.8
GPIO0: length 19.4
  Top Layer w0.17: U1.77 10.15,48.28 9.92,48.51 8.79,48.51 3.46,53.84 3.46,54.24
  Top Layer w0.254: CN1.3 2.75,61.51 2.75,54.95 3.46,54.24
GPIO1: length 18.4
  Top Layer w0.17: U1.78 9.75,47.4 9.35,47 8.42,47 7.01,48.41 v2(6.67,48.41)
  Bottom Layer w0.17: v2(6.67,48.41) 6.35,48.73 6.35,55.6 1.55,60.4
GPIO2: length 15
  Top Layer w0.17: U1.79 9.35,47.53 9.16,47.34 8.74,47.34 5.94,50.14 v2(5.25,50.14)
  Bottom Layer w0.17: v2(5.25,50.14) 5.25,54.16 1.55,57.86
GPIO3: length 10.7
  Top Layer w0.17: 1.55,55.32 1.55,54.91 8.56,47.91 U1.80
GPIO4: length 9
  Top Layer w0.2: U1.1 7.32,46.8 2.08,52.04 2.08,52.56 arc(1.84,52.72) 1.55,52.78
GPIO5: length 7.9
  Top Layer w0.2: 1.55,50.24 3.38,50.24 7.22,46.4 U1.2
GPIO6: length 7
  Top Layer w0.2: U1.3 6.96,46 5.26,47.7 1.55,47.7
GPIO7: length 6.6
  Top Layer w0.17: 1.55,45.16 2.13,45.74 6.81,45.74 6.95,45.6 U1.4
GPIO8: length 7.2
  Top Layer w0.17: 1.55,42.62 3.7,44.77 7.81,44.77 U1.6
GPIO9: length 9.3
  Top Layer w0.17: 1.55,40.08 1.63,40.08 2.74,41.19 2.74,43.19 3.95,44.4 U1.7
GPIO10: length 11.2
  Top Layer w0.17: 1.55,37.54 3.01,39 3.01,42.86 4.15,44 U1.8
GPIO11: length 13.4
  Top Layer w0.17: U1.9 7.37,43.6 7.24,43.73 4.48,43.73 3.29,42.54 3.29,36.94 1.55,35.2 1.55,35
GPIO12: length 14.8
  Top Layer w0.17: 1.55,32.46 3.56,34.47 3.56,41.61 4.66,42.71 7.28,42.71 7.37,42.8 U1.11
GPIO13: length 16.9
  Top Layer w0.17: U1.12 4.95,42.4 3.83,41.28 3.83,32.08 1.67,29.92 1.55,29.92
GPIO14: length 18.8
  Top Layer w0.17: U1.13 5.09,42 4.1,41.01 4.1,29.93 1.55,27.38
GPIO15: length 20.9
  Top Layer w0.17: U1.14 5.15,41.6 4.37,40.82 4.37,27.66 1.55,24.84
GPIO16: length 22.3
  Top Layer w0.17: 1.55,22.3 4.65,25.4 4.65,39.7 5.75,40.8 U1.16
GPIO17: length 24.4
  Top Layer w0.17: U1.17 5.95,40.4 4.92,39.37 4.92,23.13 1.55,19.76
GPIO18: length 26.3
  Top Layer w0.17: 1.55,17.22 5.19,20.86 5.19,38.84 6.35,40 U1.18
GPIO19: length 28.2
  Top Layer w0.17: 1.55,14.68 5.46,18.59 5.46,38.31 6.75,39.6 U1.19
GPIO20: length 30.1
  Top Layer w0.17: 1.55,12.14 5.73,16.32 5.73,37.78 7.15,39.2 U1.20
GPIO21: length 31.6
  Top Layer w0.17: 1.55,9.6 6.01,14.06 6.01,35.15 U1.21
GPIO22: length 34.3
  Top Layer w0.17: U1.22 9.35,37.6 6.28,34.53 6.28,11.79 1.55,7.06
GPIO23: length 37
  Top Layer w0.17: 1.55,4.52 6.55,9.52 6.55,33.89 9.75,37.09 U1.23
GPIO24: length 41.5
  Top Layer w0.17: v2(8.27,34.84) 8.32,34.9 9.09,34.9 10.55,36.36 U1.25
  Bottom Layer w0.17: 23.95,4.52 8.27,20.2 v2(8.27,34.84)
GPIO25: length 37.4
  Top Layer w0.17: U1.26 10.95,35.99 v2(9.75,34.8)
  Bottom Layer w0.17: v2(9.75,34.8) 9.75,21.26 23.95,7.06
GPIO26: length 34.4
  Top Layer w0.17: U1.27 11.35,35.63 v2(10.56,34.83)
  Bottom Layer w0.17: v2(10.56,34.83) 10.56,22.99 23.95,9.6
GPIO27: length 31.3
  Top Layer w0.17: v2(11.35,34.8) 11.35,35.11 11.62,35.38 11.62,37.4 11.75,37.53 U1.28
  Bottom Layer w0.17: 23.95,12.14 11.35,24.74 v2(11.35,34.8)
GPIO28: length 27.1
  Top Layer w0.17: 23.95,14.68 16.95,21.68 16.95,34.8 14.95,36.8 U1.36
GPIO29: length 24.4
  Top Layer w0.17: 23.95,17.22 17.55,23.62 17.55,34.8 15.35,37 U1.37
GPIO30: length 21.7
  Top Layer w0.17: 23.95,19.76 18.35,25.36 18.35,34.8 15.75,37.4 U1.38
GPIO31: length 19
  Top Layer w0.17: 23.95,22.3 18.95,27.3 18.95,34.92 16.15,37.72 U1.39
GPIO32: length 16.3
  Top Layer w0.17: U1.40 19.55,35.09 19.55,29.24 23.95,24.84
GPIO33: length 15.9
  Top Layer w0.17: U1.42 19.57,39.6 21.08,38.09 21.08,30.25 23.95,27.38
GPIO34: length 13.9
  Top Layer w0.17: 23.95,29.92 21.55,32.32 21.55,38.2 19.75,40 U1.43
GPIO35: length 11.9
  Top Layer w0.17: 23.95,32.46 22.15,34.26 22.15,38.2 19.95,40.4 U1.44
GPIO36: length 9.9
  Top Layer w0.17: U1.45 18.15,40.8 18.22,40.73 20.22,40.73 22.75,38.2 22.75,36.2 23.95,35
GPIO37: length 7.8
  Top Layer w0.17: 23.95,37.54 20.49,41 18.35,41 18.15,41.2 U1.46
GPIO38: length 6.9
  Top Layer w0.17: 23.95,40.08 22.76,41.27 18.46,41.27 18.13,41.6 U1.47
GPIO39: length 6.9
  Top Layer w0.17: 23.95,42.62 22.87,41.54 18.58,41.54 18.12,42 U1.48
GPIO40_ADC0: length 8.1
  Top Layer w0.17: 23.95,45.16 23.75,44.96 23.75,44.59 20.97,41.81 18.69,41.81 18.1,42.4 U1.49
GPIO41_ADC1: length 8.1
  Top Layer w0.17: 23.95,47.7 23.95,47.49 20.15,43.69 18.6,43.69 18.51,43.6 U1.52
GPIO42_ADC2: length 10.3
  Top Layer w0.17: U1.53 18.15,44 18.2,44.05 20.13,44.05 21.91,45.84 21.91,47.76 23.95,49.8 23.95,50.24
GPIO43_ADC3: length 12.4
  Top Layer w0.17: 23.95,52.78 21.64,50.47 21.64,45.95 20.14,44.45 18.2,44.45 18.15,44.4 U1.54
GPIO44_ADC4: length 14.6
  Top Layer w0.17: U1.55 18.15,44.8 18.2,44.85 20.16,44.85 21.37,46.06 21.37,52.74 23.95,55.32
GPIO45_ADC5: length 16.8
  Top Layer w0.17: U1.56 18.15,45.2 18.2,45.25 20.17,45.25 21.09,46.17 21.09,55.2 23.75,57.86 23.95,57.86
GPIO46_ADC6: length 18.9
  Top Layer w0.17: 23.95,60.4 20.82,57.27 20.82,46.29 20.19,45.65 18.2,45.65 18.15,45.6 U1.57
GPIO47_ADC7: length 21
  Top Layer w0.17: 23.95,62.94 20.55,59.54 20.55,46.4 20.2,46.05 18.2,46.05 18.15,46 U1.58
QSPI_SCLK: length 8
  Top Layer w0.17: U2.6 9.5,53.55 9.75,53.8 10.18,53.8 10.88,53.1 10.88,50.09 12.55,48.42 U1.71
QSPI_SD0: length 6.2
  Top Layer w0.17: U2.5 10.61,52.6 10.61,49.97 12.15,48.43 U1.72
QSPI_SD1: length 3.8
  Top Layer w0.17: U1.74 11.35,48.28 10.31,49.33 9.42,49.33 9,49.75 U2.2
QSPI_SD2: length 3.7
  Top Layer w0.17: U1.73 11.75,48.4 10.55,49.6 9.75,49.6 9.5,49.85 U2.3
QSPI_SD3: length 9.3
  Top Layer w0.17: U1.70 12.95,48.4 11.15,50.2 11.15,53.4 10.48,54.07 9.42,54.07 9,53.65 U2.7
QSPI_SS: length 6
  Top Layer w0.17: U2.1 8.5,49.87 9.31,49.06 10.19,49.06 10.95,48.3 U1.75
  Top Layer w0.254: U2.1 8.5,51.01 R5.2
SWCLK: length 10.2
  Top Layer w0.254: U1.33 13.75,37.55 14.05,37.25 14.05,29.86 SWD.1
SWDIO: length 4.9
  Top Layer w0.254: SWD.3 14.55,34.44 14.55,37.26 14.15,37.66 U1.34
USB_D+: length 4
  Top Layer w0.254: 12.5,61.62 12.38,61.75 arc(12.11,61.86) 12,62.12 USB1.B6 ; 12.5,61.62 12.62,61.75 arc(12.89,61.86) 13,62.12 USB1.A6 ; 12.5,61.62 12.5,60.62
USB_D-: length 4.8
  Top Layer w0.254: USB1.A7 12.5,63.5 arc(12.61,63.77) 12.88,63.88 13.12,63.88 arc(13.39,63.77) 13.5,63.5 USB1.B7
  Top Layer w0.3: 13.5,60.75 USB1.B7
USB_DM: length 3.1
  Top Layer w0.15: U1.66 14.55,48.4 13.35,49.6 R3.1
USB_DP: length 3.3
  Top Layer w0.15: U1.67 14.15,48.37 12.55,49.97 R2.1
VREG_AVDD: length 2.8
  Top Layer w0.254: R1.1 17.88,49.08 C13.2 17.85,48.73 17.03,47.91 U1.61
VREG_LX: length 4
  Top Layer w0.254: U1.63 15.75,50.9 L1.1
VSYS: length 9.8
  Top Layer w0.6: U4.3 D1.1
  Top Layer w0.8: 23.95,65.48 D1.1
XIN: length 10.8
  Top Layer w0.17: U1.30 12.55,35 arc(12.32,34.43) 11.75,34.2 10.95,34.2 arc(10.38,33.97) 10.15,33.4 10.15,32.4 arc(9.84,31.66) 9.1,31.35
  Top Layer w0.324: C19.1 U3.1
XOUT: length 4.6
  Top Layer w0.17: U1.31 12.95,37.6 12.9,37.55 12.9,34.62 12.75,34.48 R4.1
$1N292: length 1.4
  Top Layer w0.254: USB1.B5 11,62.08 R6.1
$1N293: length 1.6
  Top Layer w0.254: USB1.A5 14,62.15 14.55,61.6 R7.1
$1N767: length 4.4
  Top Layer w0.324: R5.1 SW1.2
$1N2957: length 2.5
  Top Layer w0.324: U3.3 R4.2 C18.2
$1N4117: length 1
  Top Layer w0.254: 6.15,63.83 6.04,63.94 LED1.1
$1N4264: length 1.3
  Top Layer w0.254: 3.46,55.31 4.43,55.31 4.64,55.11

## Copper pours and planes (outline as drawn; the poured copper is in the pictures)
+1V1 on Top Layer: 13.74,50.63 14.97,50.63 14.97,49.22 13.74,49.22
+1V1 on Top Layer: 10.15,45.6 15.35,45.6 15.35,40.4 10.15,40.4
+3V3 on Top Layer: 0.15,70.2 25.35,70.2 25.35,-0.2 0.15,-0.2
GND on Top Layer: 13.8,61.25 15.1,61.25 15.1,52.55 13.8,52.55
GND on Top Layer: 10.85,61.2 12.15,61.2 12.15,54.3 10.85,54.3
GND on Bottom Layer: 0.15,70.2 25.35,70.2 25.35,0 0.15,0
VBUS on Top Layer: 10.55,66.4 18.75,66.4 18.75,64.47 10.55,64.47
USB_D+ on Top Layer: 12.16,61.23 12.82,61.23 12.82,50.8 12.16,50.8
USB_D- on Top Layer: 12.55,61.22 13.77,61.22 13.77,50.8 12.55,50.8
VSYS on Top Layer: 17.05,60.72 20.75,60.72 20.75,55.8 17.05,55.8

## Text on the board
Bottom Silkscreen Layer: A45 | G44 | A43 | A42 | A41 | A40 | GP39 | GP38 | GP37 | GP36 | GP35 | GP34 | GP33 | GP32 | GP31 | GP30 | GP29 | GP28 | GP27 | GP26 | GP25 | GP24 | A47 | A46 | GND | +5V | +3V3 | GP2 | GP3 | GP4 | GP5 | GP6 | GP7 | GP8 | GP9 | GP10 | GP11 | GP12 | GP13 | GP14 | GP15 | GP16 | GP17 | GP18 | GP19 | GP20 | GP21 | GP22 | GP0 | GP1 | GP23
Top Silkscreen Layer: Pico | BOOT0 | 0 | 23 | 24 | 47 | PLUS | 2
